# Altium project Power_Management.PrjPcb
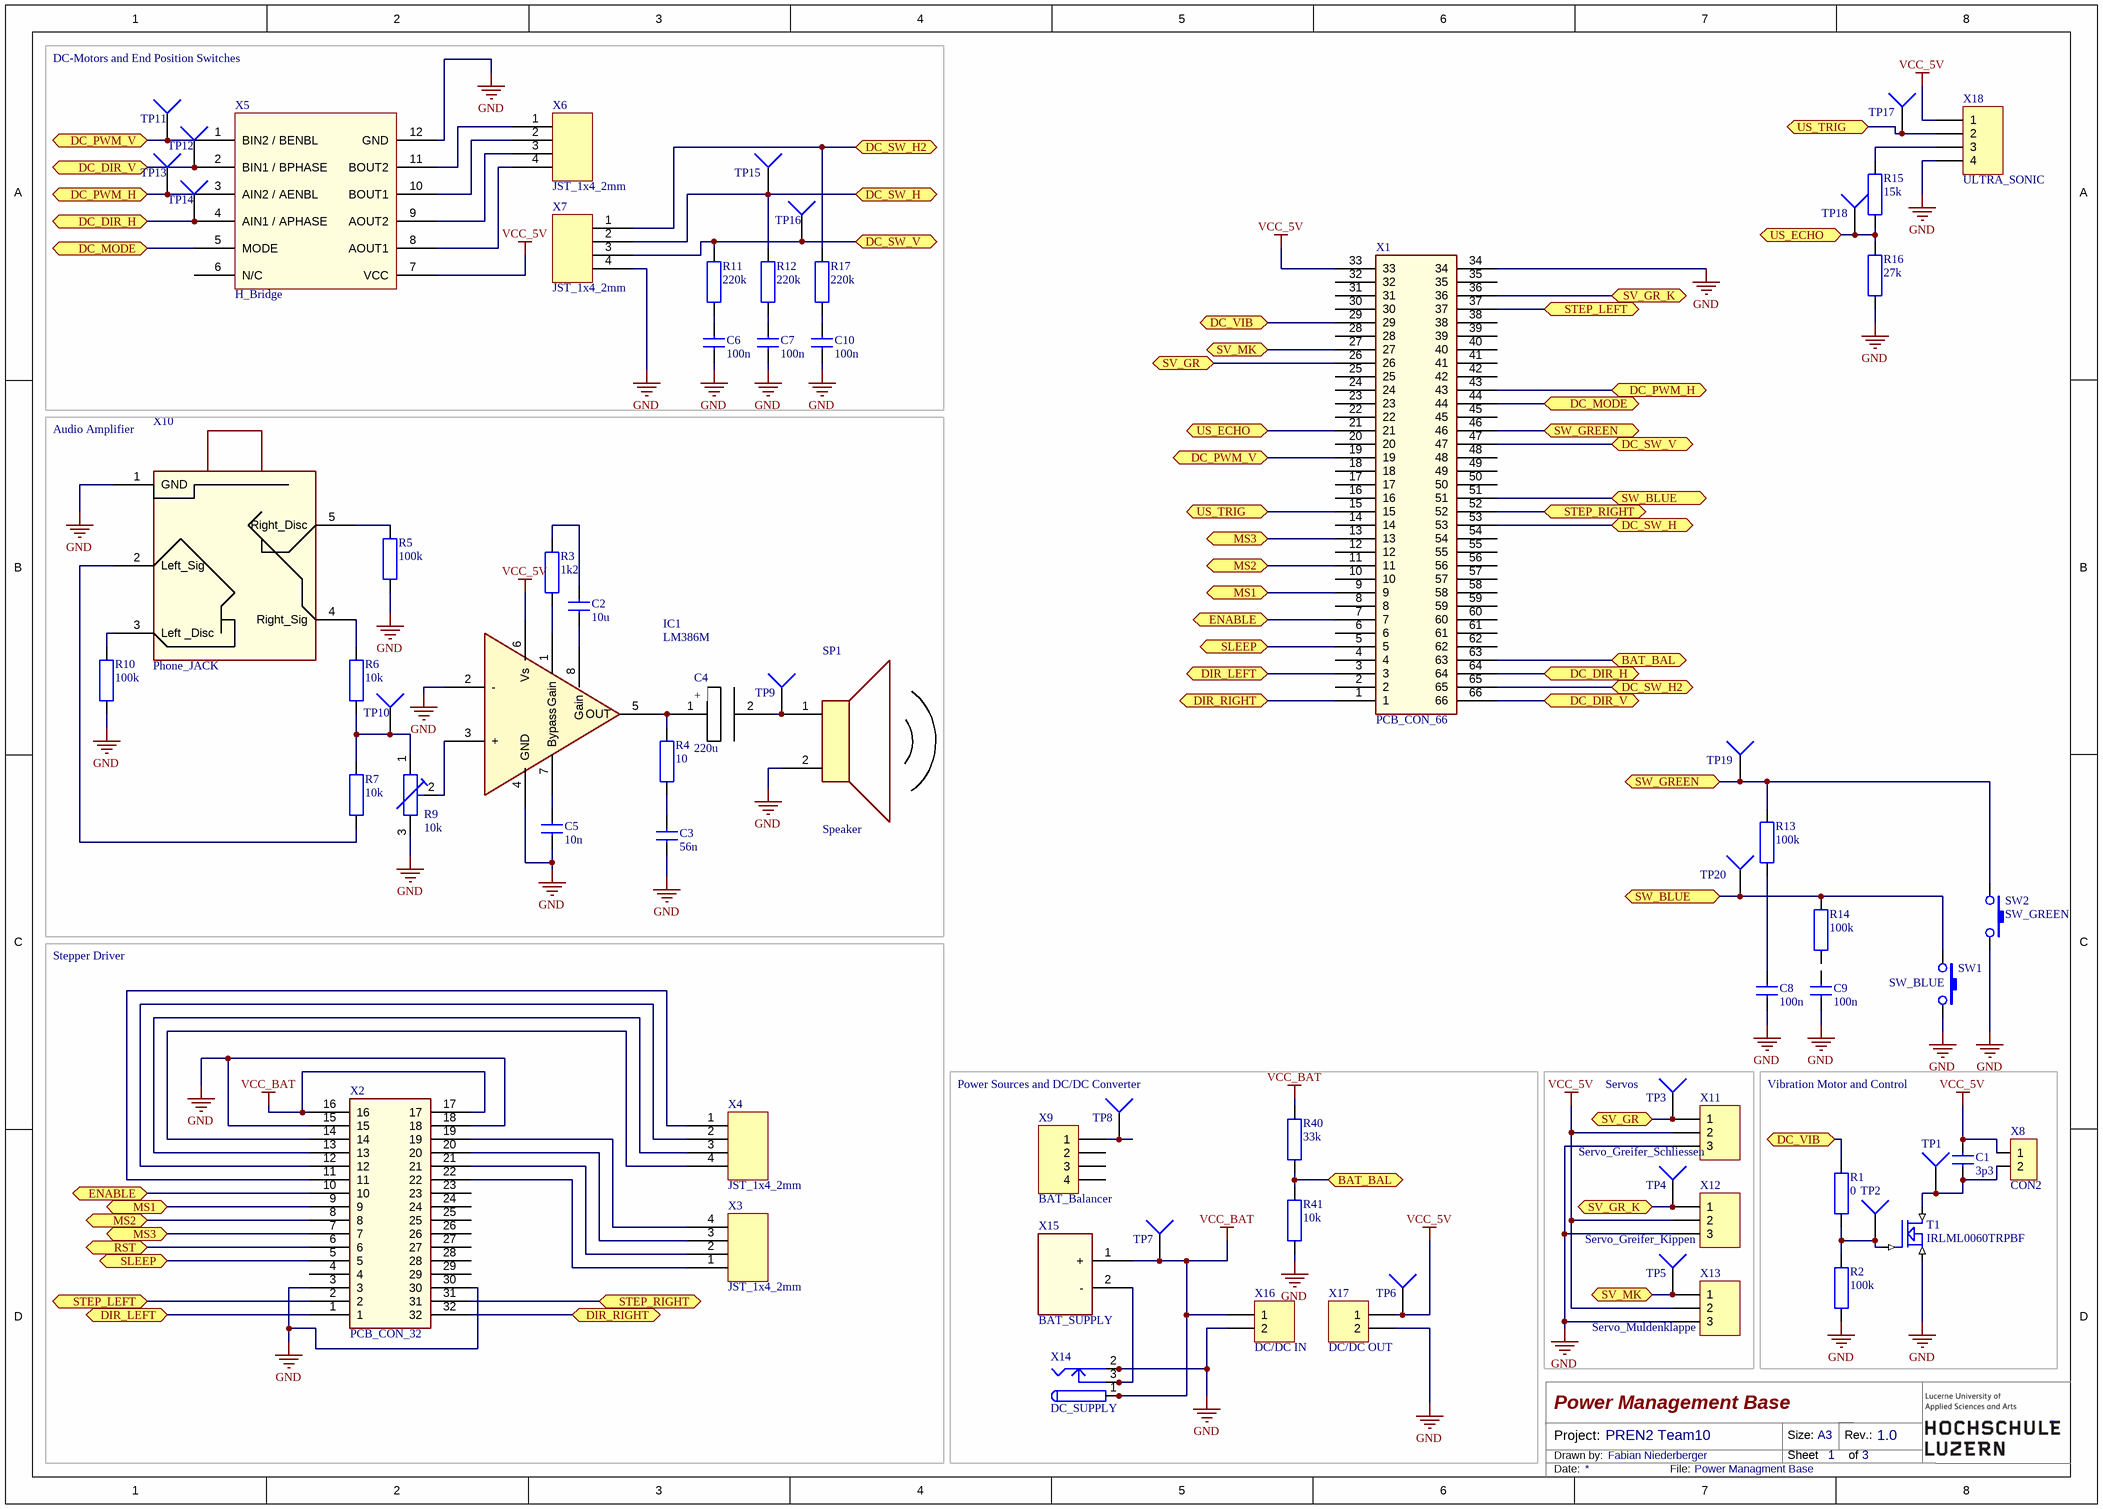
[diagram p0: PowerManagement_Base_v2.SchDoc]
3 sheets, 85 parts. Net scope: flat (ports and power ports of the same name join across sheets).
Board files: PowerManagement_Base.PcbDoc, PowerManagement_uC.PcbDoc, PowerManagement_Driver.PcbDoc
Sheets:
  PowerManagement_Base_v2.SchDoc
  PowerManagement_uC_v2.SchDoc
  PowerManagement_Driver.SchDoc

## Sheet PowerManagement_Base_v2.SchDoc: Power Management Base
size A3; DrawnBy: Fabian Niederberger; Engineer: Fabian Niederberger; Organization: HSLU T&A; Address1: Abteilung Elektrotechnik; Address2: Technikumsstrasse 21; Address3: CH-6048 Horw; DocumentNumber: 1; Revision: 1.0; SheetNumber: 1; SheetTotal: 3; Projektname: PREN2 Team10; pcbDesigner: Fabian Niederberger; DocumentName: Power Managment Base; ProjectName: Power Managment Base

### Parts
C1  3p3  [0805]
C2  10u  [0805]
C3  56n  [0805]
C4  220u  [Elko]
C5  10n  [0805]
C6  100n  [0805]
C7  100n  [0805]
C8  100n  [0805]
C9  100n  [0805]
C10  100n  [0805]
IC1  LM386M  [SO-8]
R1  0  [0805]
R2  100k  [0805]
R3  1k2  [0805]
R4  10  [0805]
R5  100k  [0805]
R6  10k  [0805]
R7  10k  [0805]
R9  10k  [POT2]
R10  100k  [0805]
R11  220k  [0805]
R12  220k  [0805]
R13  100k  [0805]
R14  100k  [0805]
R15  15k  [0805]
R16  27k  [0805]
R17  220k  [0805]
R40  33k  [0805]
R41  10k  [0805]
SP1  Speaker  [Speaker]
SW1  SW_BLUE  [TASTER]
SW2  SW_GREEN  [TASTER]
T1  IRLML0060TRPBF  [SOT-23]
TP1  (no value)  [PIN1]
TP2  (no value)  [PIN1]
TP3  (no value)  [PIN1]
TP4  (no value)  [PIN1]
TP5  (no value)  [PIN1]
TP6  (no value)  [PIN1]
TP7  (no value)  [PIN1]
TP8  (no value)  [PIN1]
TP9  (no value)  [PIN1]
TP10  (no value)  [PIN1]
TP11  (no value)  [PIN1]
TP12  (no value)  [PIN1]
TP13  (no value)  [PIN1]
TP14  (no value)  [PIN1]
TP15  (no value)  [PIN1]
TP16  (no value)  [PIN1]
TP17  (no value)  [PIN1]
TP18  (no value)  [PIN1]
TP19  (no value)  [PIN1]
TP20  (no value)  [PIN1]
X1  PCB_CON_66  [PCB_CON_66_JACK]
X2  PCB_CON_32  [PCB_CON_32_JACK]
X3  JST_1x4_2mm  [JST_1x4_2mm_horizontal]
X4  JST_1x4_2mm  [JST_1x4_2mm_horizontal]
X5  H_Bridge  [H_Bridge]
X6  JST_1x4_2mm  [JST_1x4_2mm_horizontal]
X7  JST_1x4_2mm  [JST_1x4_2mm_horizontal]
X8  CON2  [HDR1X2]
X9  BAT_Balancer  [HDR1X4]
X10  Phone_JACK  [Audio_CON 3.5mm]
X11  Servo_Greifer_Schliessen  [HDR1X3]
X12  Servo_Greifer_Kippen  [HDR1X3]
X13  Servo_Muldenklappe  [HDR1X3]
X14  DC_SUPPLY  [KLD-0202]
X15  BAT_SUPPLY  [XT60_CON]
X16  DC/DC IN  [HDR1X2H]
X17  DC/DC OUT  [HDR1X2H]
X18  ULTRA_SONIC  [HDR1X4]

### Blocks framed on the sheet
DC-Motors and End Position Switches: C6 C7 C10 R11 R12 R17 TP11-TP16 X5-X7
Audio Amplifier: C2-C5 IC1 R3-R7 R9 R10 SP1 TP9 TP10 X10
Stepper Driver: X2-X4
Power Sources and DC/DC Converter: R40 R41 TP6-TP8 X9 X14-X17
Servos: TP3-TP5 X11-X13
Vibration Motor and Control: C1 R1 R2 T1 TP1 TP2 X8

### Ports
BAT_BAL, DC_DIR_H, DC_DIR_V, DC_MODE, DC_PWM_H, DC_PWM_V, DC_SW_H, DC_SW_H2, DC_SW_V, DC_VIB, DIR_LEFT, DIR_RIGHT, ENABLE, MS1, MS2, MS3, RST, SLEEP, STEP_LEFT, STEP_RIGHT, SV_GR, SV_GR_K, SV_MK, SW_BLUE, SW_GREEN, US_ECHO, US_TRIG

### Nets
GND: C3.2 C5.2 C6.2 C7.2 C8.2 C9.2 C10.2 IC1.2(-) IC1.4(GND) R2.1 R5.1 R9.3 R10.1 R16.1 R41.1 SP1.2 SW1.2 SW2.2 T1.SOURCE X1.34 X2.3 X2.15 X2.18 X2.30 X5.12(GND) X7.4 X10.1(GND) X11.3 X12.3 X13.3 X14.2 X14.2A X14.2B X16.2 X17.2 X18.4
VCC_5V: C1.2 IC1.6(Vs) TP6.1 X1.33 X5.7(VCC) X8.1 X11.2 X12.2 X13.2 X17.1 X18.1
VCC_BAT: R40.2 TP7.1 X2.16 X2.17 X14.1 X14.1A X14.1B X15.1(+) X16.1
NetC1_1: C1.1 T1.DRAIN TP1.1 X8.2
NetC2_1: C2.1 R3.2
NetC2_2: C2.2 IC1.8(Gain)
NetC3_1: C3.1 R4.1
NetC4_1: C4.1 IC1.5(OUT) R4.2
NetC4_2: C4.2 SP1.1 TP9.1
NetC5_1: C5.1 IC1.7(Bypass)
NetC6_1: C6.1 R11.1
NetC7_1: C7.1 R12.1
NetC8_1: C8.1 R13.1
NetC10_1: C10.1 R17.1
NetIC1_1: IC1.1(Gain) R3.1
NetIC1_3: IC1.3(+) R9.2
NetR1_1: R1.1 R2.2 T1.GATE TP2.1
NetR1_2: R1.2 X1.29 ; port DC_VIB
NetR5_2: R5.2 X10.5(Right_Disc)
NetR6_1: R6.1 X10.4(Right_Sig)
NetR6_2: R6.2 R7.1 R9.1 TP10.1
NetR7_2: R7.2 X10.2(Left_Sig)
NetR10_2: R10.2 X10.3(Left__Disc)
NetR11_2: R11.2 TP16.1 X1.47 X7.3 ; port DC_SW_V
NetR12_2: R12.2 TP15.1 X1.53 X7.2 ; port DC_SW_H
NetR13_2: R13.2 SW2.1 TP19.1 X1.46 ; port SW_GREEN
NetR14_2: R14.2 SW1.1 TP20.1 X1.51 ; port SW_BLUE
NetR15_1: R15.1 R16.2 TP18.1 X1.21 ; port US_ECHO
NetR15_2: R15.2 X18.3
NetR17_2: R17.2 X1.65 X7.1 ; port DC_SW_H2
NetR40_1: R40.1 R41.2 X1.63 ; port BAT_BAL
NetTP3_1: TP3.1 X1.26 X11.1 ; port SV_GR
NetTP4_1: TP4.1 X1.36 X12.1 ; port SV_GR_K
NetTP5_1: TP5.1 X1.27 X13.1 ; port SV_MK
NetTP8_1: TP8.1 X9.1
NetTP11_1: TP11.1 X1.19 X5.1(BIN2_/_BENBL) ; port DC_PWM_V
NetTP12_1: TP12.1 X1.66 X5.2(BIN1_/_BPHASE) ; port DC_DIR_V
NetTP13_1: TP13.1 X1.43 X5.3(AIN2_/_AENBL) ; port DC_PWM_H
NetTP14_1: TP14.1 X1.64 X5.4(AIN1_/_APHASE) ; port DC_DIR_H
NetTP17_1: TP17.1 X1.15 X18.2 ; port US_TRIG
NetX1_1: X1.1 X2.32 ; port DIR_RIGHT
NetX1_3: X1.3 X2.1 ; port DIR_LEFT
NetX1_5: X1.5 X2.5 ; port SLEEP
NetX1_7: X1.7 X2.10 ; port ENABLE
NetX1_9: X1.9 X2.9 ; port MS1
NetX1_11: X1.11 X2.8 ; port MS2
NetX1_13: X1.13 X2.7 ; port MS3
NetX1_37: X1.37 X2.2 ; port STEP_LEFT
NetX1_44: X1.44 X5.5(MODE) ; port DC_MODE
NetX1_52: X1.52 X2.31 ; port STEP_RIGHT
NetX2_6: X2.6 ; port RST
NetX2_11: X2.11 X4.1
NetX2_12: X2.12 X4.2
NetX2_13: X2.13 X4.3
NetX2_14: X2.14 X4.4
NetX2_19: X2.19 X3.4
NetX2_20: X2.20 X3.3
NetX2_21: X2.21 X3.2
NetX2_22: X2.22 X3.1
NetX5_8: X5.8(AOUT1) X6.4
NetX5_9: X5.9(AOUT2) X6.3
NetX5_10: X5.10(BOUT1) X6.2
NetX5_11: X5.11(BOUT2) X6.1
NetX14_3: X14.3 X14.3A X14.3B X15.2(-)

Not connected (* = marked no-connect by the designer): C9 1; R14 1; X1 2 4 6 8 10 12 14 16 17 18 20 22 23 24 25 28 30 31 32 35 38 39 40 41 42 45 48 49 50 54 55 56 57 58 59 60 61 62; X2 4 23 24 25 26 27 28 29; X5 6(N/C); X9 2 3 4

### Notes on the sheet
- Project:
- Drawn by:
- Size:
- Sheet
- A3
- Rev.:
- of
- Date:
- File:
- (in symbol Elko) +

### Library data of the parts
C1-C3 C5 = C?: Normaler Kondensator
C4 = Elko: Electrolyt Capacitor
C6 C8 C9 = C?: Normaler Kondensator; DC_Motor: DC_Motor_Switches_Debounce_C
C7 C10 = C?: Normaler Kondensator; DC_Motor: DC_Motor_Swtiches_Debounce_C
IC1 = Audio Amp: Audio AMP in SO-8 Package
R1-R7 R10 R13-R16 R40 R41 = R?: Normaler Widerstand
R9 = R_POT1
R11 R12 R17 = R?: Normaler Widerstand; DC_Motor: DC_Motor_Switch_Debounce
SP1 = Speaker: 8 Ohm Speaker
SW1 SW2 = SW-PB
T1 = MOSFET N
TP1-TP20 = Socket: LatestRevisionDate: 17-Jul-2002; LatestRevisionNote: Re-released for DXP Platform.; Publisher: Altium Limited
X1 = PCB_CON_66: Connects a PCB with another. This scheme is either jack or plug, depends on footprint
X2 = PCB_CON_32: Connects a PCB with another. This scheme is either jack or plug, depends on footprint
X3 X4 = JST_1x4_2mm: JST connector single row 4 pin, 2mm grid
X5 = H_Bridge: H-Bridge Shield
X6 = JST_1x4_2mm: JST connector single row 4 pin, 2mm grid; DC_Motor: DC_Motor_CON
X7 = JST_1x4_2mm: JST connector single row 4 pin, 2mm grid; DC_Motor: DC_Motor_Switches
X9 X18 = Header 4: Header, 4-Pin; LatestRevisionDate: 17-Jul-2002; LatestRevisionNote: Re-released for DXP Platform.; Publisher: Altium Limited
X10 = Phone_JACK: 3.5 mm Phone Jack Stereo with Disconnect information
X11-X13 = Header 3: Header, 3-Pin; LatestRevisionDate: 17-Jul-2002; LatestRevisionNote: Re-released for DXP Platform.; Publisher: Altium Limited
X14 = PWR2.5: Low Voltage Power Supply Connector; Published: 17-Dec-2003; DatasheetDocument: 09-May-2002; Publisher: Altium Limited; ComponentLink1Description: Manufacturer Link; ComponentLink1URL: http://domino.kycon.com/internet/Products.html
X15 = XT60_CON: XT60 LiPo Accumulator Connector
X16 X17 = Header 2H: Header, 2-Pin, Right Angle; LatestRevisionDate: 17-Jul-2002; LatestRevisionNote: Re-released for DXP Platform.; Publisher: Altium Limited

## Sheet PowerManagement_uC_v2.SchDoc: Power Management uC
size A3; DrawnBy: Fabian Niederberger; Engineer: Fabian Niederberger; Organization: HSLU T&A; Address1: Abteilung Elektrotechnik; Address2: Technikumsstrasse 21; Address3: CH-6048 Horw; DocumentNumber: 2; Revision: 1.0; SheetNumber: 2; SheetTotal: 3; Projektname: PREN2 Team 10; pcbDesigner: Fabian Niederberger; DocumentName: Power Management uC; ProjectName: PREN2 Team 10
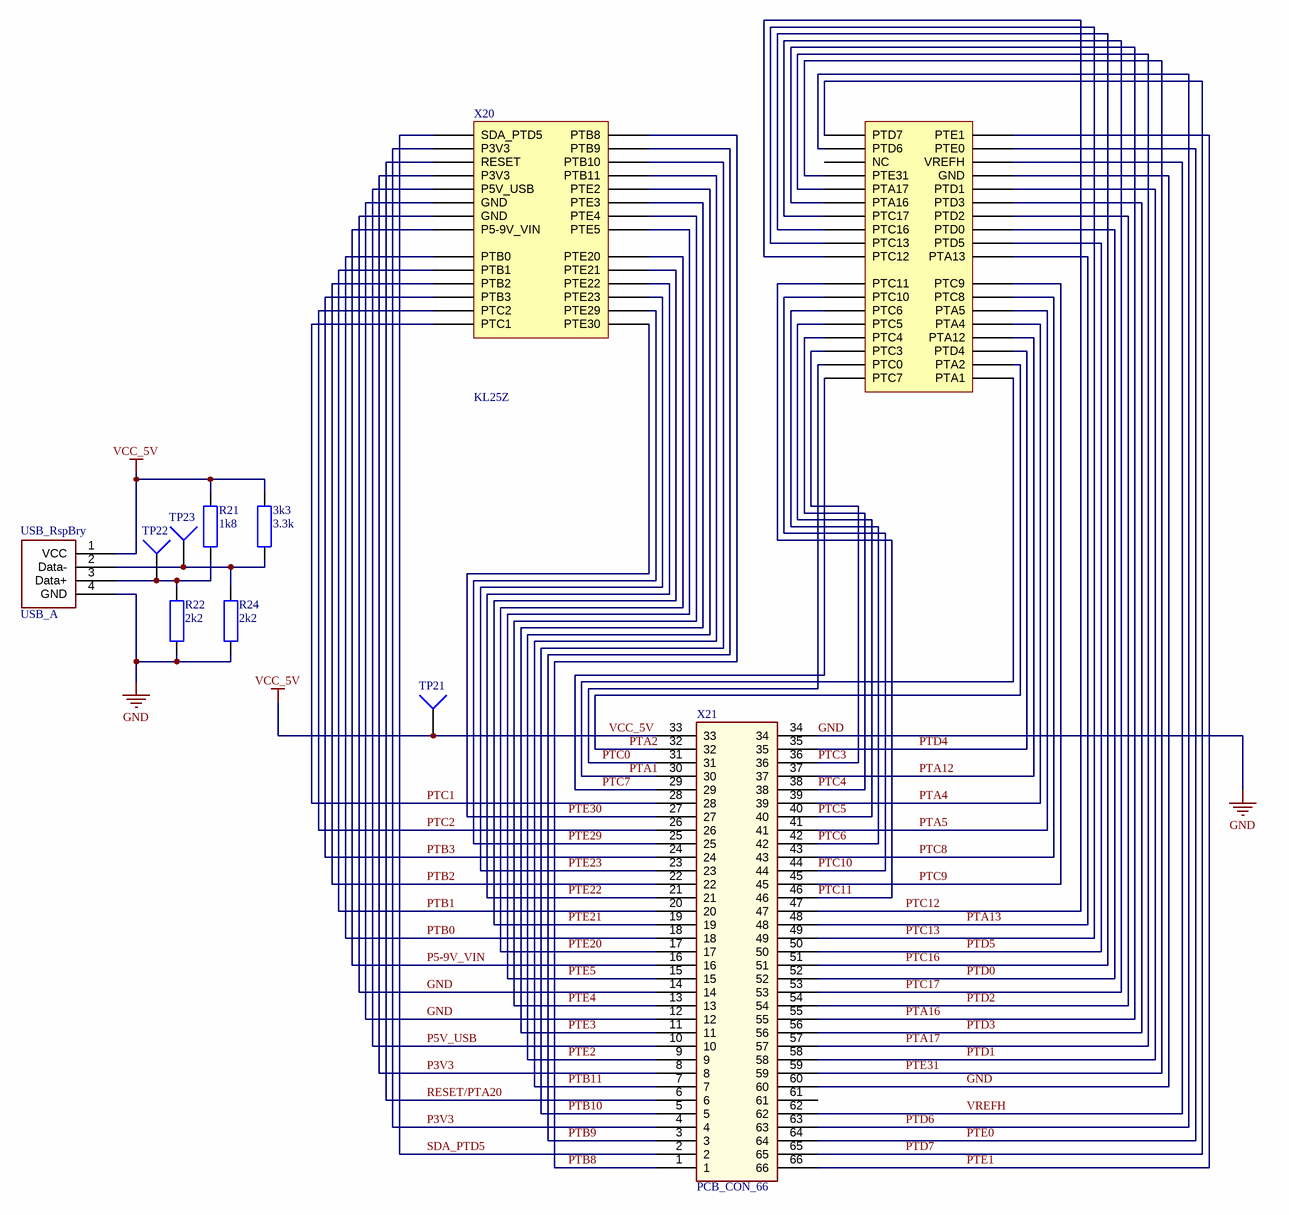
[diagram p1: PowerManagement_uC_v2.SchDoc]

### Parts
3k3  3.3k  [0805]
R21  1k8  [0805]
R22  2k2  [0805]
R24  2k2  [0805]
TP21  (no value)  [PIN1]
TP22  (no value)  [PIN1]
TP23  (no value)  [PIN1]
USB_RspBry  USB_A  [USB_A]
X20  KL25Z  [Freedom KL25Z Headerarray]
X21  PCB_CON_66  [PCB_CON_66_PLUG]

### Nets
GND: R22.1 R24.1 USB_RspBry.4(GND) X20.11(GND) X20.13(GND) X20.36(GND) X21.12 X21.14 X21.34 X21.60
VCC_5V: 3k3.2 R21.2 TP21.1 USB_RspBry.1(VCC) X21.33
P3V3: X20.3(P3V3) X20.7(P3V3) X21.4 X21.8
P5-9V_VIN: X20.15(P5-9V_VIN) X21.16
P5V_USB: X20.9(P5V_USB) X21.10
PTA1: X20.64(PTA1) X21.30
PTA2: X20.62(PTA2) X21.32
PTA4: X20.56(PTA4) X21.39
PTA5: X20.54(PTA5) X21.41
PTA12: X20.58(PTA12) X21.37
PTA13: X20.48(PTA13) X21.48
PTA16: X20.39(PTA16) X21.55
PTA17: X20.37(PTA17) X21.57
PTB0: X20.17(PTB0) X21.18
PTB1: X20.19(PTB1) X21.20
PTB2: X20.21(PTB2) X21.22
PTB3: X20.23(PTB3) X21.24
PTB8: X20.2(PTB8) X21.1
PTB9: X20.4(PTB9) X21.3
PTB10: X20.6(PTB10) X21.5
PTB11: X20.8(PTB11) X21.7
PTC0: X20.61(PTC0) X21.31
PTC1: X20.27(PTC1) X21.28
PTC2: X20.25(PTC2) X21.26
PTC3: X20.59(PTC3) X21.36
PTC4: X20.57(PTC4) X21.38
PTC5: X20.55(PTC5) X21.40
PTC6: X20.53(PTC6) X21.42
PTC7: X20.63(PTC7) X21.29
PTC8: X20.52(PTC8) X21.43
PTC9: X20.50(PTC9) X21.45
PTC10: X20.51(PTC10) X21.44
PTC11: X20.49(PTC11) X21.46
PTC12: X20.47(PTC12) X21.47
PTC13: X20.45(PTC13) X21.49
PTC16: X20.43(PTC16) X21.51
PTC17: X20.41(PTC17) X21.53
PTD0: X20.44(PTD0) X21.52
PTD1: X20.38(PTD1) X21.58
PTD2: X20.42(PTD2) X21.54
PTD3: X20.40(PTD3) X21.56
PTD4: X20.60(PTD4) X21.35
PTD5: X20.46(PTD5) X21.50
PTD6: X20.31(PTD6) X21.63
PTD7: X20.29(PTD7) X21.65
PTE0: X20.32(PTE0) X21.64
PTE1: X20.30(PTE1) X21.66
PTE2: X20.10(PTE2) X21.9
PTE3: X20.12(PTE3) X21.11
PTE4: X20.14(PTE4) X21.13
PTE5: X20.16(PTE5) X21.15
PTE20: X20.18(PTE20) X21.17
PTE21: X20.20(PTE21) X21.19
PTE22: X20.22(PTE22) X21.21
PTE23: X20.24(PTE23) X21.23
PTE29: X20.26(PTE29) X21.25
PTE30: X20.28(PTE30) X21.27
PTE31: X20.35(PTE31) X21.59
RESET/PTA20: X20.5(RESET) X21.6
SDA_PTD5: X20.1(SDA_PTD5) X21.2
VREFH: X20.34(VREFH) X21.62
Net3k3_1: 3k3.1 R24.2 TP23.1 USB_RspBry.2(Data-)
NetR21_1: R21.1 R22.2 TP22.1 USB_RspBry.3(Data+)

Not connected (* = marked no-connect by the designer): X20 33(NC); X21 61

### Notes on the sheet
- Project:
- Drawn by:
- Size:
- Sheet
- A3
- Rev.:
- of
- Date:
- File:

### Library data of the parts
3k3 R21 R22 R24 = R?: Normaler Widerstand
TP21-TP23 = Socket: LatestRevisionDate: 17-Jul-2002; LatestRevisionNote: Re-released for DXP Platform.; Publisher: Altium Limited
X20 = Freedom KL25Z Header: FRDM KL25Z Shield
X21 = PCB_CON_66: as X1 on sheet PowerManagement_Base_v2

## Sheet PowerManagement_Driver.SchDoc: Power Management Driver
size A3; DrawnBy: Fabian Niederberger; Engineer: Fabian Niederberger; Organization: HSLU T&A; Address1: Abteilung Elektrotechnik; Address2: Technikumsstrasse 21; Address3: CH-6048 Horw; DocumentNumber: 3; Revision: 1.0; SheetNumber: 3; SheetTotal: 3; Projektname: PREN2 Team 10; pcbDesigner: Fabian Niederberger; DocumentName: Power Management Driver; ProjectName: PREN2 Team 10
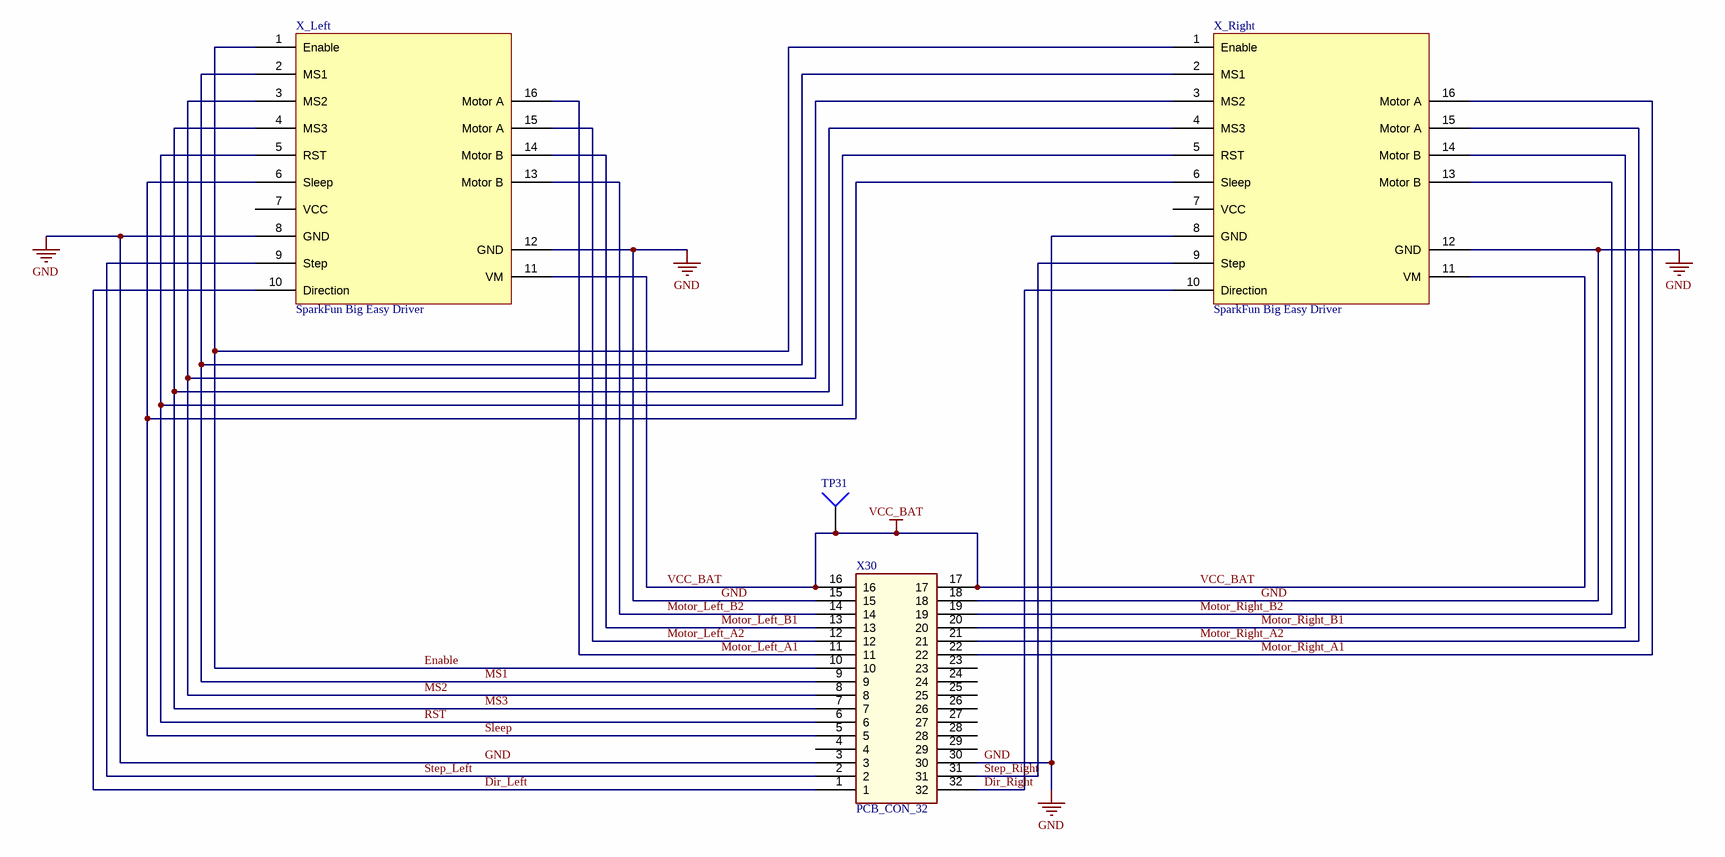
[diagram p2: PowerManagement_Driver.SchDoc]

### Parts
TP31  (no value)  [PIN1]
X30  PCB_CON_32  [PCB_CON_32_PLUG]
X_Left  SparkFun Big Easy Driver  [SPARKFUN_BIG_EASY_DRIVER]
X_Right  SparkFun Big Easy Driver  [SPARKFUN_BIG_EASY_DRIVER]

### Nets
GND: X30.3 X30.15 X30.18 X30.30 X_Left.8(GND) X_Left.12(GND) X_Right.8(GND) X_Right.12(GND)
VCC_BAT: TP31.1 X30.16 X30.17 X_Left.11(VM) X_Right.11(VM)
Dir_Left: X30.1 X_Left.10(Direction)
Dir_Right: X30.32 X_Right.10(Direction)
Enable: X30.10 X_Left.1(Enable) X_Right.1(Enable)
Motor_Left_A1: X30.11 X_Left.16(Motor_A)
Motor_Left_A2: X30.12 X_Left.15(Motor_A)
Motor_Left_B1: X30.13 X_Left.14(Motor_B)
Motor_Left_B2: X30.14 X_Left.13(Motor_B)
Motor_Right_A1: X30.22 X_Right.16(Motor_A)
Motor_Right_A2: X30.21 X_Right.15(Motor_A)
Motor_Right_B1: X30.20 X_Right.14(Motor_B)
Motor_Right_B2: X30.19 X_Right.13(Motor_B)
MS1: X30.9 X_Left.2(MS1) X_Right.2(MS1)
MS2: X30.8 X_Left.3(MS2) X_Right.3(MS2)
MS3: X30.7 X_Left.4(MS3) X_Right.4(MS3)
RST: X30.6 X_Left.5(RST) X_Right.5(RST)
Sleep: X30.5 X_Left.6(Sleep) X_Right.6(Sleep)
Step_Left: X30.2 X_Left.9(Step)
Step_Right: X30.31 X_Right.9(Step)

Not connected (* = marked no-connect by the designer): X30 4 23 24 25 26 27 28 29; X_Left 7(VCC); X_Right 7(VCC)

### Notes on the sheet
- Project:
- Drawn by:
- Size:
- Sheet
- A3
- Rev.:
- of
- Date:
- File:

### Library data of the parts
TP31 = Socket: LatestRevisionDate: 17-Jul-2002; LatestRevisionNote: Re-released for DXP Platform.; Publisher: Altium Limited
X30 = PCB_CON_32: as X2 on sheet PowerManagement_Base_v2
X_Left X_Right = SparkFun Big Easy Driver: Stepper Motor Driver with 4 wires

## Nets that join several sheets
GND: PowerManagement_Base_v2 (36 pins), PowerManagement_uC_v2 (10 pins), PowerManagement_Driver (8 pins)
VCC_5V: PowerManagement_Base_v2 (11 pins), PowerManagement_uC_v2 (5 pins)
VCC_BAT: PowerManagement_Base_v2 (9 pins), PowerManagement_Driver (5 pins)